# Altium project Practica_3_Rober.PrjPcb
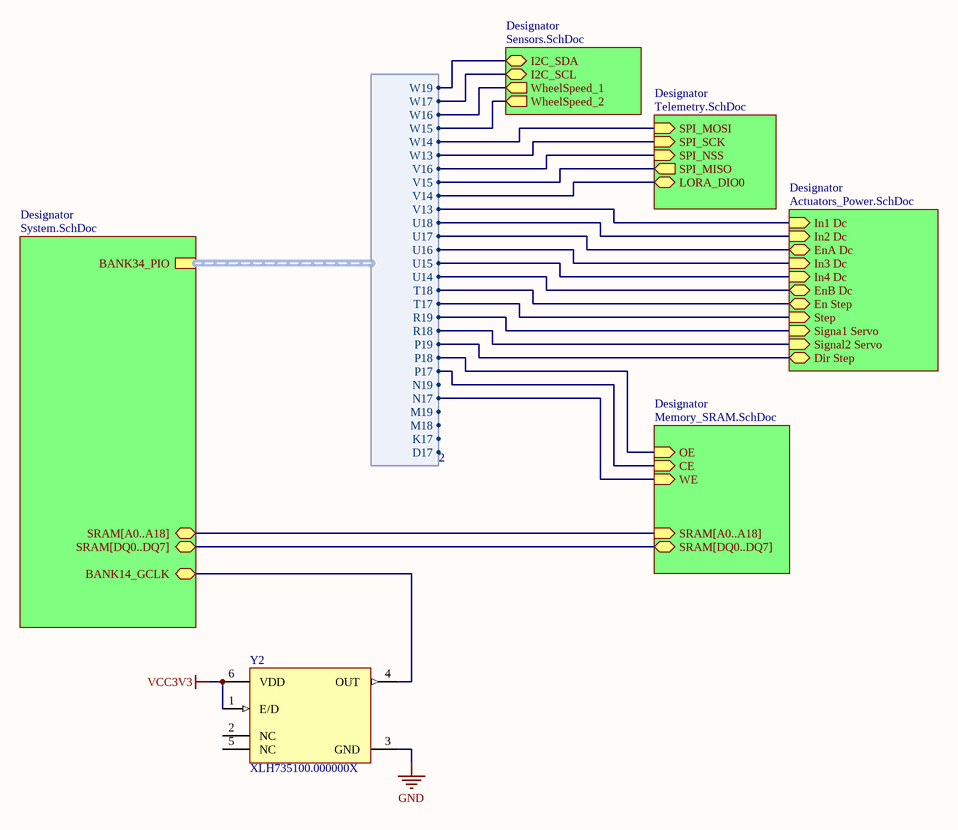
[diagram p0: Main_TopSheet.SchDoc]
7 sheets, 137 parts. Net scope: hierarchical (ports join the sheet entries above them; power ports are global).
Board file: PCB1.PcbDoc
Sheets:
  Main_TopSheet.SchDoc
    Designator = Sensors.SchDoc
    Designator = Telemetry.SchDoc
    Designator = Actuators_Power.SchDoc
    Designator = System.SchDoc
    Designator = Memory_SRAM.SchDoc
  Power.SchDoc

## Sheet Main_TopSheet.SchDoc
size A4; SheetNumber: 1; SheetTotal: 7

### Parts
Y2  XLH735100.000000X  [JU6_MFG]

### Sub-sheets
Designator = Sensors.SchDoc: I2C_SDA (bidir), I2C_SCL (bidir), WheelSpeed_1 (out), WheelSpeed_2 (out)
Designator = Telemetry.SchDoc: SPI_MOSI (in), SPI_SCK (in), SPI_NSS (in), SPI_MISO (out), LORA_DIO0 (bidir)
Designator = Actuators_Power.SchDoc: In1 Dc (in), In2 Dc (in), EnA Dc (bidir), In3 Dc (in), In4 Dc (in), EnB Dc (bidir), En Step (bidir), Step (in), Signa1 Servo (in), Signal2 Servo (in), Dir Step (bidir)
Designator = System.SchDoc: BANK34_PIO (harness 2), BANK14_GCLK (bidir), SRAM[A0..A18] (bidir), SRAM[DQ0..DQ7] (bidir)
Designator = Memory_SRAM.SchDoc: CE (in), OE (in), WE (in), SRAM[A0..A18] (in), SRAM[DQ0..DQ7] (bidir)

### Harnesses
2: D17, K17, M18, M19, N17, N19, P17, P18, P19, R18, R19, T17, T18, U14, U15, U16, U17, U18, V13, V14, V15, V16, W13, W14, W15, W16, W17, W19

### Nets
GND: Y2.3(GND)
VCC3V3: Y2.1(E/D) Y2.6(VDD) ; sheet Designator/WheelSpeed_1, sheet Designator/WheelSpeed_2, sheet Designator/BANK34_PIO.W15, sheet Designator/BANK34_PIO.W16
NetLoRa1_8: sheet Designator/LORA_DIO0, sheet Designator/BANK34_PIO.V14
NetLoRa1_16: sheet Designator/SPI_SCK, sheet Designator/BANK34_PIO.W13
NetLoRa1_17: sheet Designator/SPI_MISO, sheet Designator/BANK34_PIO.V15
NetLoRa1_18: sheet Designator/SPI_MOSI, sheet Designator/BANK34_PIO.W14
NetLoRa1_19: sheet Designator/SPI_NSS, sheet Designator/BANK34_PIO.V16
NetMD7_18: sheet Designator/I2C_SDA, sheet Designator/BANK34_PIO.W19
NetMD7_19: sheet Designator/I2C_SCL, sheet Designator/BANK34_PIO.W17
NetP1_1: sheet Designator/Signal2 Servo, sheet Designator/BANK34_PIO.R18
NetP2_1: sheet Designator/Signa1 Servo, sheet Designator/BANK34_PIO.R19
NetU1C_L17: Y2.4(OUT) ; sheet Designator/BANK14_GCLK
NetU2#2_B3: sheet Designator/WE, sheet Designator/BANK34_PIO.N17
NetU2#2_G2: sheet Designator/OE, sheet Designator/BANK34_PIO.P18
NetU2#2_G3: sheet Designator/CE, sheet Designator/BANK34_PIO.P17
NetU9_5: sheet Designator/In1 Dc, sheet Designator/BANK34_PIO.V13
NetU9_6: sheet Designator/EnA Dc, sheet Designator/BANK34_PIO.U17
NetU9_7: sheet Designator/In2 Dc, sheet Designator/BANK34_PIO.U18
NetU9_10: sheet Designator/In3 Dc, sheet Designator/BANK34_PIO.U16
NetU9_11: sheet Designator/In4 Dc, sheet Designator/BANK34_PIO.U15
NetU9_12: sheet Designator/EnB Dc, sheet Designator/BANK34_PIO.U14
NetU10_1: sheet Designator/En Step, sheet Designator/BANK34_PIO.T18
NetU10_7: sheet Designator/Step, sheet Designator/BANK34_PIO.T17
NetU10_8: sheet Designator/Dir Step, sheet Designator/BANK34_PIO.P19

Not connected (* = marked no-connect by the designer): Y2 2(NC) 5(NC)

### Library data of the parts
Y2 = CMP-00572-106941302-3: Crystal ROHS3Compliant Enable/Disable Active Oscillator -20C~70C 47mA 0.055 1.40mm 100MHz; Max Output Frequency: 999.9MHz; Min Input Voltage: 3.135V; Output Type: LVCMOS; Max Input Voltage: 3.465V; ComponentLink1Description: Manufacturer's Website; ComponentLink2URL: https://octopart.com/cad-content/api/get-model-datasheet/15189/106941302; Case/Package: CLCC; Number of Pins: 6; Mount: Surface Mount; ComponentLink2Description: Datasheet URL; Min Operating Temperature: -20°C; HelpURL: https://octopart.com/cad-content/api/get-model-datasheet/15189/106941302; ComponentLink3Description: Manufacturer's Package Drawing; RoHS: Compliant; ComponentLink3URL: https://www.renesas.com/en/document/psc/ju6-package-outline-70-x-50-mm-body-13-mm-thick; Height: 1.45mm; Max Operating Temperature: 70°C; ComponentLink1URL: http://www.renesas.com

## Sheet Sensors.SchDoc
size A4; SheetNumber: 5; SheetTotal: 7
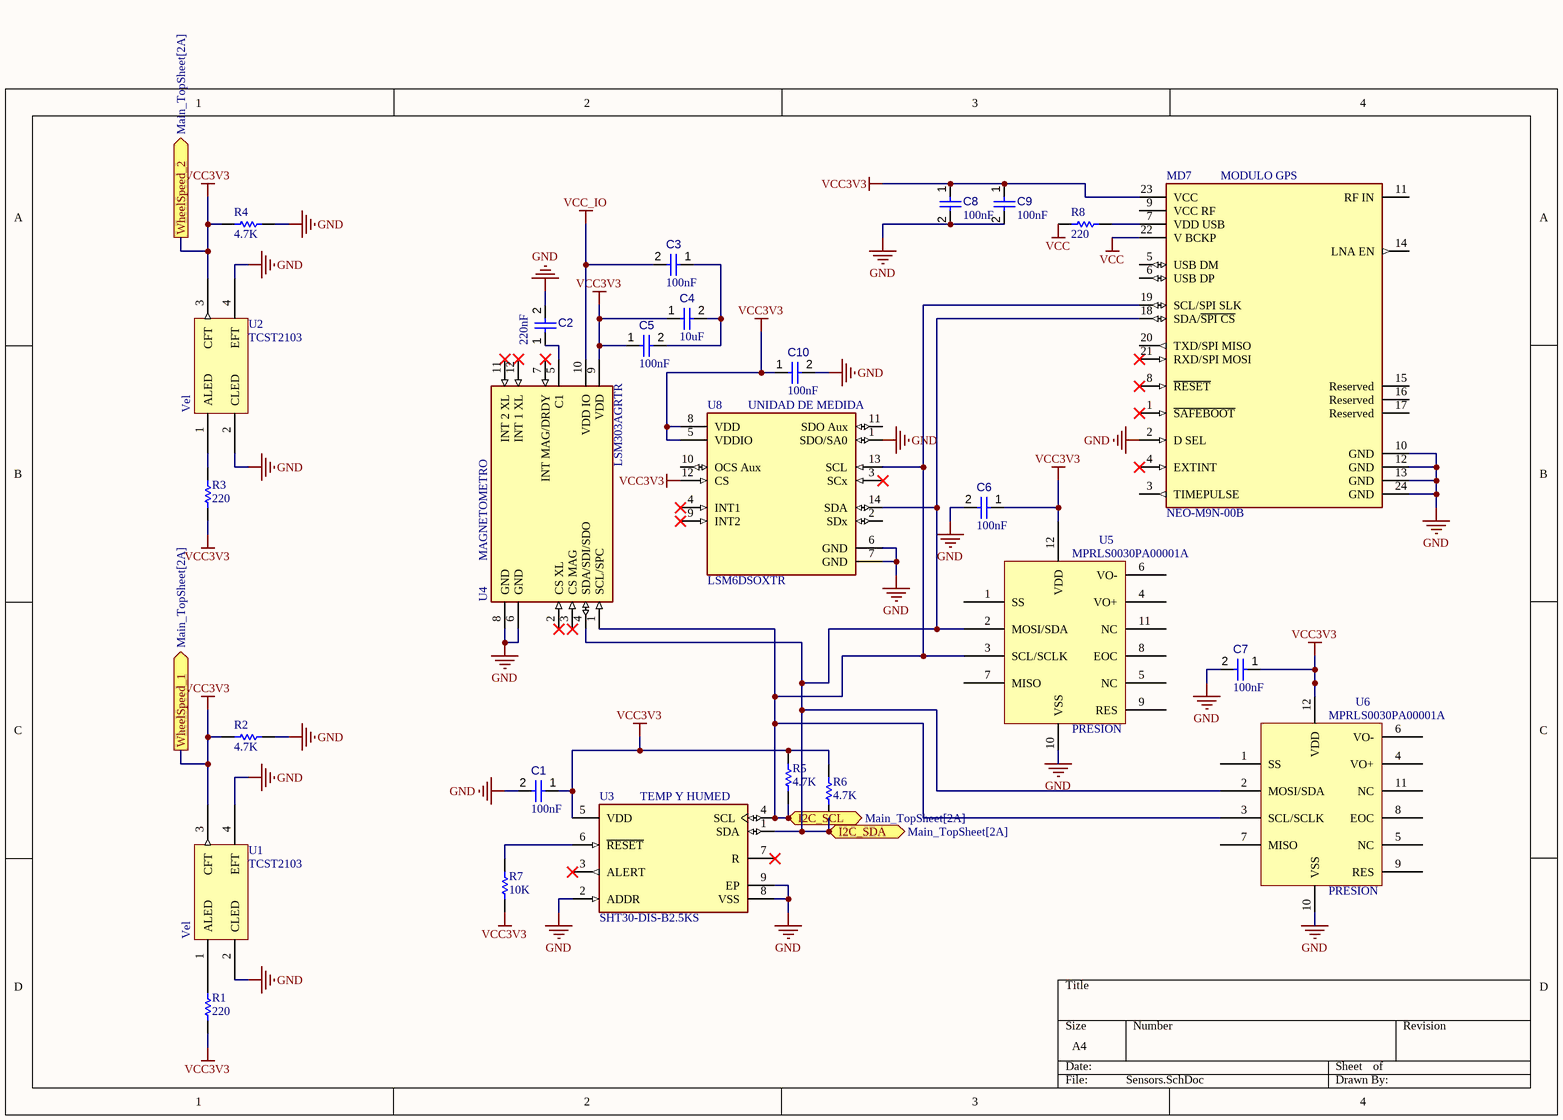
[diagram p1: Sensors.SchDoc]

### Parts
(Parts that share a designator on the sheet are numbered #1, #2 ... from top to bottom, then left to right.)
C1  value 100nF  [CAPC0402(1005)60_L]  (hidden comment: Capacitor 100nF +/-20% 10V 0402)
C2  value 220nF  [CAPC0402(1005)60_L]  (hidden comment: Capacitor 100nF +/-20% 10V 0402)
C3  value 100nF  [CAPC0402(1005)60_L]  (hidden comment: Capacitor 100nF +/-20% 10V 0402)
C4#1  value 10uF  [CAPC0402(1005)60_L]  (hidden comment: Capacitor 100nF +/-20% 10V 0402)
C5  value 100nF  [CAPC0402(1005)60_L]  (hidden comment: Capacitor 100nF +/-20% 10V 0402)
C6#1  value 100nF  [CAPC0402(1005)60_L]  (hidden comment: Capacitor 100nF +/-20% 10V 0402)
C7#1  value 100nF  [CAPC0402(1005)60_L]  (hidden comment: Capacitor 100nF +/-20% 10V 0402)
C8#1  value 100nF  [CAPC0402(1005)60_L]  (hidden comment: Capacitor 100nF +/-20% 10V 0402)
C9#1  value 100nF  [CAPC0402(1005)60_L]  (hidden comment: Capacitor 100nF +/-20% 10V 0402)
C10#1  value 100nF  [CAPC0402(1005)60_L]  (hidden comment: Capacitor 100nF +/-20% 10V 0402)
MD7  NEO-M9N-00B  [FP-NEO-M9N-00B-MFG]
R1  value 220  [RESC1005X40X25ML05T10]  (hidden comment: Resistor 51k +/-5% 0402 63 mW)
R2  value 4.7K  [RESC1005X40X25ML05T10]  (hidden comment: Resistor 51k +/-5% 0402 63 mW)
R3  value 220  [RESC1005X40X25ML05T10]  (hidden comment: Resistor 51k +/-5% 0402 63 mW)
R4  value 4.7K  [RESC1005X40X25ML05T10]  (hidden comment: Resistor 51k +/-5% 0402 63 mW)
R5  value 4.7K  [RESC1005X40X25ML05T10]  (hidden comment: Resistor 51k +/-5% 0402 63 mW)
R6  value 4.7K  [RESC1005X40X25ML05T10]  (hidden comment: Resistor 51k +/-5% 0402 63 mW)
R7  value 10K  [RESC1005X40X25ML05T10]  (hidden comment: Resistor 51k +/-5% 0402 63 mW)
R8  value 220  [RESC1005X40X25ML05T10]  (hidden comment: Resistor 51k +/-5% 0402 63 mW)
U1  TCST2103  [TCST2103-Footprint-1]
U2#1  TCST2103  [TCST2103-Footprint-1]
U3  SHT30-DIS-B2.5KS  [FP-SHT30-DIS-B2_5KS-MFG]
U4  LSM303AGRTR  [FP-LGA-12-8487206-MFG]
U5  MPRLS0030PA00001A  [LGA12C85P2X6_500X500X150]
U6  MPRLS0030PA00001A  [LGA12C85P2X6_500X500X150]
U8  LSM6DSOXTR  [FP-LGA-14L-DM00249496-MFG]

### Ports
I2C_SCL (bidir, see Main_TopSheet[2A]), I2C_SDA (bidir, see Main_TopSheet[2A]), WheelSpeed_1 (out, see Main_TopSheet[2A]), WheelSpeed_2 (out, see Main_TopSheet[2A])

### Nets
GND: C1.2 C2.2 C6#1.2 C7#1.2 C8#1.2 C9#1.2 C10#1.2 MD7.2(D_SEL) MD7.10(GND) MD7.12(GND) MD7.13(GND) MD7.24(GND) R2.2 R4.2 U1.2(CLED) U1.4(EFT) U2#1.2(CLED) U2#1.4(EFT) U3.2(ADDR) U3.8(VSS) U3.9(EP) U4.6(GND) U4.8(GND) U5.10(VSS) U6.10(VSS) U8.1(SDO/SA0) U8.6(GND) U8.7(GND)
VCC: MD7.22(V_BCKP) R8.2
VCC3V3: C1.1 C4#1.1 C5.1 C6#1.1 C7#1.1 C8#1.1 C9#1.1 C10#1.1 MD7.23(VCC) R1.2 R2.1 R3.2 R4.1 R5.1 R6.1 R7.2 U1.3(CFT) U2#1.3(CFT) U3.5(VDD) U4.9(VDD) U5.12(VDD) U6.12(VDD) U8.5(VDDIO) U8.8(VDD) U8.12(CS) ; port WheelSpeed_1, port WheelSpeed_2
VCC_IO: C3.2 U4.10(VDD_IO)
NetC2_1: C2.1 U4.5(C1)
NetC3_1: C3.1 C4#1.2 C5.2
NetMD7_7: MD7.7(VDD_USB) R8.1
NetMD7_18: MD7.18(SDA/~{SPI_CS}) R6.2 U3.1(SDA) U4.4(SDA/SDI/SDO) U5.2(MOSI/SDA) U6.2(MOSI/SDA) U8.14(SDA) ; port I2C_SDA
NetMD7_19: MD7.19(SCL/SPI_SLK) R5.2 U3.4(SCL) U4.1(SCL/SPC) U5.3(SCL/SCLK) U6.3(SCL/SCLK) U8.13(SCL) ; port I2C_SCL
NetR1_1: R1.1 U1.1(ALED)
NetR3_1: R3.1 U2#1.1(ALED)
NetR7_1: R7.1 U3.6(~{RESET})

Not connected (* = marked no-connect by the designer): MD7 1(~{SAFEBOOT})* 3(TIMEPULSE) 4(EXTINT)* 5(USB_DM) 6(USB_DP) 8(~{RESET})* 9(VCC_RF) 11(RF_IN) 14(LNA_EN) 15(Reserved) 16(Reserved) 17(Reserved) 20(TXD/SPI_MISO) 21(RXD/SPI_MOSI)*; U3 3(ALERT)* 7(R)*; U4 2(CS_XL)* 3(CS_MAG)* 7(INT_MAG/DRDY)* 11(INT_2_XL)* 12(INT_1_XL)*; U5 1(SS) 4(VO+) 5(NC) 6(VO-) 7(MISO) 8(EOC) 9(RES) 11(NC); U6 1(SS) 4(VO+) 5(NC) 6(VO-) 7(MISO) 8(EOC) 9(RES) 11(NC); U8 2(SDx) 3(SCx)* 4(INT1)* 9(INT2)* 10(OCS_Aux) 11(SDO_Aux)

### Notes on the sheet
- (near MD7) MODULO GPS
- (near U8) UNIDAD DE MEDIDA
- (near U4) MAGNETOMETRO
- (near U5) PRESION
- (near U3) TEMP Y HUMED
- (near U6) PRESION
- (in symbol CMP-010-00024-2) Vel

### Library data of the parts
C1-C3 C4#1 C5 C6#1 C7#1 C8#1 C9#1 C10#1 = CMP-001-00061-3: Chip Capacitor, 100nF +/-20%, 10V, 0402, Thickness 0.6 mm; Tolerance: 20%; Mounting Technology: SMT; Voltage Rating: 10V; Max Operating Temperature: 85°C; Pins: 2; Case/Package: 0402; Min Operating Temperature: -55°C
MD7 = CMP-207130-000006-2: M9 standard precision module; Manufacturer: u-blox; Min Supply Voltage: 1.65V; Sensitivity: -167dBm; Interface: I2C,SPI,UART,USB; Max Supply Voltage: 3.6V; Device Class L3: RF Receivers; Category: UNK; Temperature Range Low: -40°C; Temperature Range High: +85°C; ComponentLink2Description: Datasheet; Manufacturer Part Number: NEO-M9N-00B; ComponentLink2URL: https://www.u-blox.com/sites/default/files/NEO-M9N_DataSheet_%28UBX-19014285%29.pdf; Footprint Url: https://www.u-blox.com/sites/default/files/NEO-M9N_Integrationmanual_%28UBX-19014286%29.pdf; Height: 2.6mm; Automotive: No; RoHS: TRUE; Lead Free: Yes; Octopart: https://octopart.com/neo-m9n-00b-u-blox-107315722; Package: 0; Temperature: -40°C to +85°C; Device Class L1: Integrated Circuits (ICs); Device Class L2: RF Semiconductors and Devices
R1-R8 = CMP-009-00000-5: Chip Resistor, 51 KOhm, +/- 5%, 0.063 W, -55 to 155 degC, 0402 (1005 Metric); Power: 63mW; Case/Package: 0402; Min Operating Temperature: -55°C; Mounting Technology: SM; RoHS Compliant: True; Max Operating Temperature: 155°C; Tolerance: 5%; Pins: 2
U1 U2#1 = CMP-010-00024-2: Vishay TCST2103 CNY37 Photoelectric Fork Sensor Optoelectronic Sensing; Output Current: 100mA; Max Operating Temperature: 85°C; Min Operating Temperature: -55°C; Mounting Technology: Through Hole; Pins: 4
U3 = CMP-144040-000006-1: SENSOR HUMID/TEMP 5V I2C 3% SMD
U4 = CMP-2000-07465-2: IMU ACCEL/MAG I2C/SPI 12LGA; Manufacturer: STMicroelectronics; Accel Range: 2/4/8/16g; Operating Supply Current: 3.7-200uA; Sensor Output: I2C,SPI; Accel Resolution: 16bits; Max Supply Voltage: 3.6V; Min Supply Voltage: 1.71V; Mag Sense Range: 49.152gauss (g); Sensor Type: Temperature,Accelerometer,Magnetometer; Mouser Description: IMUs - Inertial Measurement Units Ultra-compact high-performance e-compass 3D accelerometer and 3D magnetometer module; Temperature Range High: +85°C; Package: LGA-12-8487206; Manufacturer Part Number: LSM303AGRTR; Category: IC; Device Class L3: Inertial Measurement Units (IMUs); Temperature: -40°C to +85°C; Device Class L2: Motion Sensors; ComponentLink2Description: Datasheet; Octopart: https://octopart.com/lsm303agrtr-stmicroelectronics-59386630; Automotive: No; Device Class L1: Sensors; Resolution: 16bits; RoHS: TRUE; Height: 1mm; ComponentLink2URL: https://www.st.com/resource/en/datasheet/lsm303agr.pdf; Lead Free: Yes; Temperature Range Low: -40°C; Footprint Url: https://www.st.com/content/ccc/resource/technical/document/technical_note/73/17/9c/16/dd/96/4a/01/CD00134799.pdf/files/CD00134799.pdf/jcr:content/translations/en.CD00134799.pdf; Digikey Description: IMU ACCEL/MAG I2C/SPI 12LGA
U5 U6 = CMP-010-00026-1: Piezoresistive Sensor, Absolute, 0Psi Min, 30Psi Max, 0.25%, 0.20-0.80V, Square, Board Mount; Min Supply Voltage: 1.8V; Max Supply Voltage: 3.6V; Max Operating Temperature: 85°C; Min Operating Temperature: -40°C
U8 = CMP-12177-000010-1: INEMO INERTIAL MODULE: 3D ACCELE; Manufacturer: STMicroelectronics; Sensor Type: Temperature,Accelerometer,Gyroscope; Accel Range: 2/4/8/16g; Accel Sensitivity: 0.061/0.122/0.244/0.488mV/g; Operating Supply Current: 0.55mA; Gyro Range: 125/250/500/1000/2000°/s; Gyro Sensitivity: 4.375/8.75/17.5/35/70LSB/°/s; Sensor Output: I2C,SPI,Other; Min Supply Voltage: 1.62V; Max Supply Voltage: 3.6V; Octopart: https://octopart.com/lsm6dsoxtr-stmicroelectronics-98102600; Package: LGA-14L-DM00249496; Footprint Url: https://www.st.com/content/ccc/resource/technical/document/technical_note/73/17/9c/16/dd/96/4a/01/CD00134799.pdf/files/CD00134799.pdf/jcr:content/translations/en.CD00134799.pdf; ComponentLink2Description: Datasheet; Mouser Description: LSM6DSOX: 3.6 V 3 Axis Accelerometer Gyroscope iNEMO Inertial Module - LGA-14L; ComponentLink2URL: https://www.st.com/resource/en/datasheet/lsm6dsox.pdf; Temperature Range Low: -40°C; Digikey Description: INEMO INERTIAL MODULE: 3D ACCELE; Lead Free: Yes; Device Class L3: Inertial Measurement Units (IMUs); Category: IC; Device Class L2: Motion Sensors; RoHS: TRUE; Temperature: -40°C to +85°C; Height: 0.86mm; Device Class L1: Sensors; Temperature Range High: +85°C; Manufacturer Part Number: LSM6DSOXTR; Automotive: No

## Sheet Telemetry.SchDoc
size A4; SheetNumber: 6; SheetTotal: 6
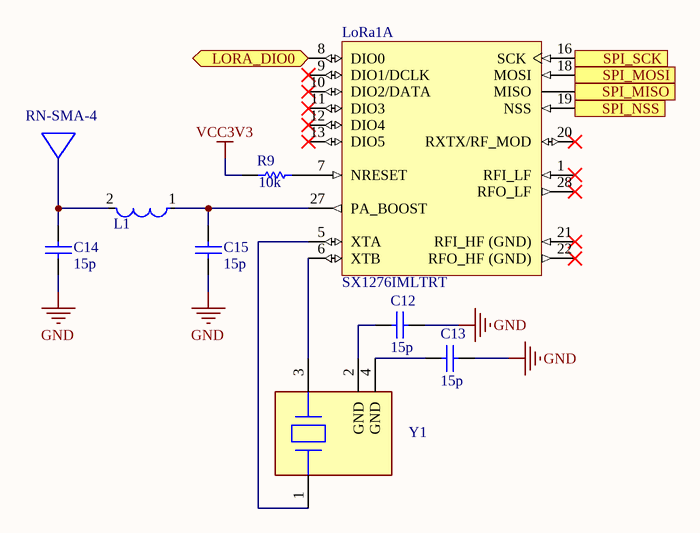
[diagram p2: Telemetry.SchDoc]

### Parts
(Parts that share a designator on the sheet are numbered #1, #2 ... from top to bottom, then left to right.)
ANT1  RN-SMA-4  [FP-RN-SMA-4-MFG]
C12#1  value 15p  (hidden comment: Capacitor)
C13  value 15p  (hidden comment: Capacitor)
C14#1  value 15p  (hidden comment: Capacitor)
C15#1  value 15p  (hidden comment: Capacitor)
L1  LQW31HN27NJ03L  [FP-LQW31HN_03-MFG]  (value not drawn)
LoRa1  SX1276IMLTRT  [SMTC-QFN-28_V]  (part A of 2)
R9  value 10k  (hidden comment: Resistor)
Y1  (no value)  [FP-ABM11AIG-MFG]

### Ports
LORA_DIO0 (bidir), SPI_MISO (out), SPI_MOSI (in), SPI_NSS (in), SPI_SCK (in)

### Nets
GND: C12#1.2 C13.2 C14#1.1 C15#1.1
VCC3V3: R9.1
NetC12#1_1: C12#1.1 Y1.2(GND)
NetC13_1: C13.1 Y1.4(GND)
NetC14#1_2: C14#1.2 L1.2
NetC15#1_2: C15#1.2 L1.1 LoRa1.27(PA_BOOST)
NetLoRa1_5: LoRa1.5(XTA) Y1.1(1_Crystal)
NetLoRa1_6: LoRa1.6(XTB) Y1.3(2_Crystal)
NetLoRa1_7: LoRa1.7(NRESET) R9.2
NetLoRa1_8: LoRa1.8(DIO0) ; port LORA_DIO0
NetLoRa1_16: LoRa1.16(SCK) ; port SPI_SCK
NetLoRa1_17: LoRa1.17(MISO) ; port SPI_MISO
NetLoRa1_18: LoRa1.18(MOSI) ; port SPI_MOSI
NetLoRa1_19: LoRa1.19(NSS) ; port SPI_NSS

Not connected (* = marked no-connect by the designer): LoRa1 1(RFI_LF)* 9(DIO1/DCLK)* 10(DIO2/DATA)* 11(DIO3)* 12(DIO4)* 13(DIO5)* 20(RXTX/RF_MOD)* 21(RFI_HF_(GND))* 22(RFO_HF_(GND))* 28(RFO_LF)*

### Library data of the parts
ANT1 = CMP-06329-000002-1: RF ANT 2.4GHZ WHIP SMA MALE 4"; Number of Bands: 1; Input Impedance: 50R; VSWR: 1.9; Bandwidth: 120MHz; Frequency: 2.45GHz; REACH SVHC: No SVHC; Height: 4.449inch; Packaging: Bulk; Case/Package: SMA; Package Quantity: 1; Lead Free: Lead Free; Series: -; Termination: SMA; Connector Type: SMA; Radiation Hardening: No; Impedance: 50R; Mount: Connector
C12#1 C13 C14#1 C15#1 = Capacitor: SimulationGenericComponent: True
L1 = CMP-06042-006372-1: Wire Wound RF Inductor 27nH ±5% 0.0714Ω 560mA 1206; Self Resonant Frequency: 1GHz; Shielding: Unshielded; Core Material: Ferrite; Test Frequency: 100MHz; Q Factor: 60; DC Resistance (DCR): 51mR; Mount: Surface Mount; Inductance: 27nH; Max DC Current: 560mA; Military Standard: Not; Height: 1.8mm; Width: 0.063inch; Case Code (Metric): 3216; Height - Seated (Max): 0.079inch; Min Operating Temperature: -40°C; Weight: 0.000705oz; Package Quantity: 2000; Max Operating Temperature: 85°C; Current Rating: 560mA; Case Code (Imperial): 1206; Packaging: Tape and Reel; DC Current: 560mA; Termination: SMD/SMT; Depth: 1.8mm; Resistor Type: Wirewound; Radiation Hardening: No; Case/Package: 1206; Length: 3.2mm; Tolerance: 5%
LoRa1 = CMP-2000-05356-1: Low Power Long Range Transceiver, 137 to 1020 MHz, -40 to 85 degC, 28-Pin QFN, RoHS, Tape and Reel; Manufacturer: Semtech; Power - Output: 20dBm; Data Rate (Max): 300kbps; Sensitivity: -148dBm; Featured Product: SX1276LongRangeTransceiver; PCN Design/Specification: CopperWire25/Mar/2014; GPIO: 6; Frequency: 137MHz~1.02GHz; Voltage - Supply: 1.8V~3.7V; Protocol: LoRa™; Current - Transmitting: 20mA~120mA; Current - Receiving: 10.8mA~12mA; Online Catalog: SX1276,SX1277andSX1278; Design Resources: SX127xReferenceDesignOverviewDevelopmentToolSelector; Serial Interfaces: SPI; Mfg Application Notes: LoRaModulation:CrystalOscillatorGuidanceSX12xxSoftwareImplementationofDataWhiteningandCRCSX127xLoRaLowEnergyDesignGuideSX127xLoRaModemDesignersGuide; Modulation: FSK,GFSK,GMSK,MSK,OOK; Other Names: SX1276IMLTRTTR; Series: -; Manufacturer URL: http://www.semtech.com/; Datasheet URL: http://www.semtech.com/images/datasheet/sx1276.pdf; Type: TxRx+MCU; RF Family/Standard: 802.15.4; Package Reference: QFN-28; Standard Package: 3,000; Package Description: 28-Pin Quad Flat No-lead Package, Body 6 x 6 mm, Pitch 0.65 mm; Category: RF/IFandRFID; Operating Temperature: -40degC~85degC; Datasheet Version: Rev. 4, 03/2015; Memory Size: -; Family: RFTransceiverICs; Packaging: Tape&Reel(TR); Package / Case: 28-VQFNExposedPad
R9 = Resistor: TC1: 0; SimulationGenericComponent: True; TC2: 0
Y1 = CMP-27762-011048-1: Crystal 32MHz ±30ppm 10pF SMD-4 2.5mm x 2mm Automotive; Frequency Stability: 100ppm; ESR (Equivalent Series Resistance): 80R; Max Operating Temperature: 125°C; Frequency Tolerance: 30ppm; Length: 0.098inch; Frequency: 32MHz; RoHS Compliant: Yes; Min Operating Temperature: -40°C; Width: 0.079inch; Load Capacitance: 10pF; Packaging: Tape and Reel; Height: 0.024inch; Mount: Surface Mount; Case/Package: SMD/SMT; Ratings: AEC-Q200

## Sheet Actuators_Power.SchDoc
size A4; SheetNumber: 4; SheetTotal: 6
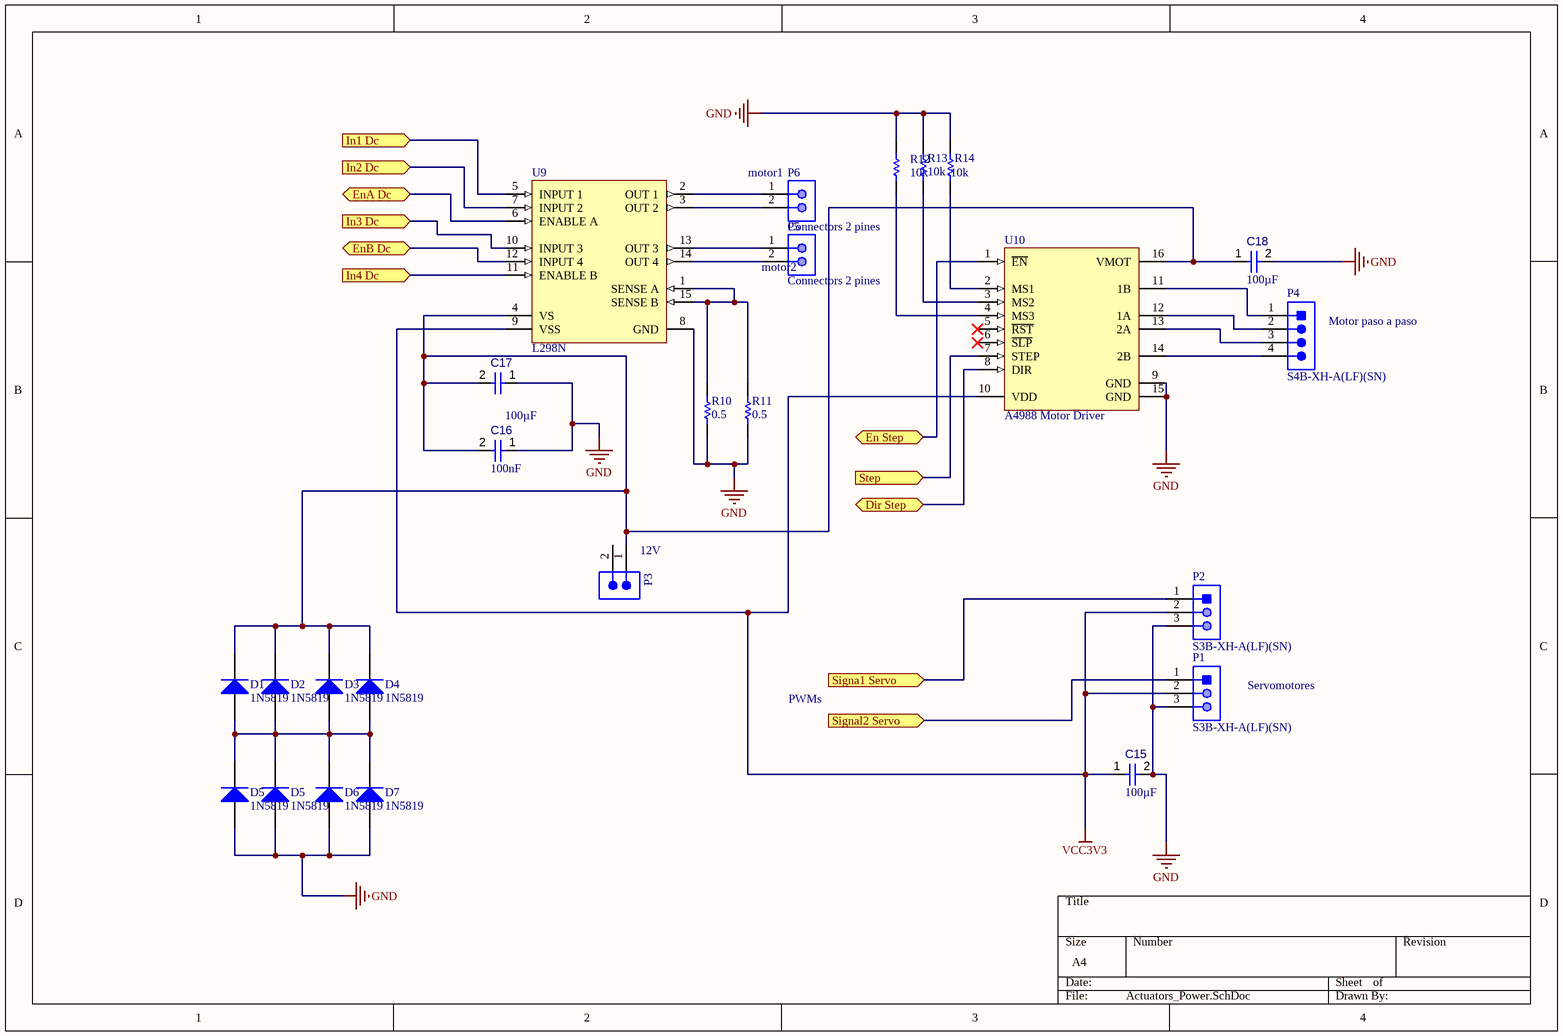
[diagram p3: Actuators_Power.SchDoc]

### Parts
(Parts that share a designator on the sheet are numbered #1, #2 ... from top to bottom, then left to right.)
C15#2  value 100µF  [CAPC3216X190X55LL30T25]  (hidden comment: Capacitor 100 uF +/- 20% 6.3 V 1206)
C16#1  value 100nF  [CAPC0402(1005)60_L]  (hidden comment: Capacitor 100nF +/-20% 10V 0402)
C17#1  value 100µF  [CAPC3216X190X55LL30T25]  (hidden comment: Capacitor 100 uF +/- 20% 6.3 V 1206)
C18#1  value 100µF  [CAPC3216X190X55LL30T25]  (hidden comment: Capacitor 100 uF +/- 20% 6.3 V 1206)
D1  1N5819  [ONSC-AXIAL_LEAD-2-59-10_P]
D2  1N5819  [ONSC-AXIAL_LEAD-2-59-10_P]
D3  1N5819  [ONSC-AXIAL_LEAD-2-59-10_P]
D4  1N5819  [ONSC-AXIAL_LEAD-2-59-10_P]
D5#1  1N5819  [ONSC-AXIAL_LEAD-2-59-10_P]
D5#2  1N5819  [ONSC-AXIAL_LEAD-2-59-10_P]
D6  1N5819  [ONSC-AXIAL_LEAD-2-59-10_P]
D7  1N5819  [ONSC-AXIAL_LEAD-2-59-10_P]
P1  S3B-XH-A(LF)(SN)  [JST-S3B-XH-A(LF)(SN)_V]
P2  S3B-XH-A(LF)(SN)  [JST-S3B-XH-A(LF)(SN)_V]
P3  691701510002B  [691701510002B]  (value not drawn)
P4  S4B-XH-A(LF)(SN)  [JST-S4B-XH-A(LF)(SN)_V]
P5  Connectors 2 pines  [AMPH-68000-102HLF_V]
P6  Connectors 2 pines  [AMPH-68000-102HLF_V]
R10  value 0.5  [RESC3116X70X50ML13T20]  (hidden comment: Resistor 1k +/-1% 1206 250 mW)
R11  value 0.5  [RESC3116X70X50ML13T20]  (hidden comment: Resistor 1k +/-1% 1206 250 mW)
R12  value 10k  [RESC3116X70X50ML13T20]  (hidden comment: Resistor 1k +/-1% 1206 250 mW)
R13  value 10k  [RESC3116X70X50ML13T20]  (hidden comment: Resistor 1k +/-1% 1206 250 mW)
R14  value 10k  [RESC3116X70X50ML13T20]  (hidden comment: Resistor 1k +/-1% 1206 250 mW)
U9  L298N  [STM-FM-15]
U10  A4988 Motor Driver  [Polo-A4988 Motor Driver_V]

### Ports
Dir Step (bidir), En Step (bidir), EnA Dc (bidir), EnB Dc (bidir), In1 Dc (in), In2 Dc (in), In3 Dc (in), In4 Dc (in), Signa1 Servo (in), Signal2 Servo (in), Step (in)

### Nets
GND: C15#2.2 C16#1.1 C17#1.1 C18#1.2 D5#1.1(A) D5#2.1(A) D6.1(A) D7.1(A) P1.3 P2.3 R10.1 R11.1 R12.2 R13.2 R14.2 U9.8(GND) U10.9(GND) U10.15(GND)
VCC3V3: C15#2.1 P1.2 P2.2 U9.9(VSS) U10.10(VDD)
NetC16#1_2: C16#1.2 C17#1.2 C18#1.1 D1.2(K) D2.2(K) D3.2(K) D4.2(K) P3.1 U9.4(VS) U10.16(VMOT)
NetD1_1: D1.1(A) D2.1(A) D3.1(A) D4.1(A) D5#1.2(K) D5#2.2(K) D6.2(K) D7.2(K)
NetP1_1: P1.1 ; port Signal2 Servo
NetP2_1: P2.1 ; port Signa1 Servo
NetP4_1: P4.1 U10.11(1B)
NetP4_2: P4.2 U10.12(1A)
NetP4_3: P4.3 U10.13(2A)
NetP4_4: P4.4 U10.14(2B)
NetP5_1: P5.1 U9.13(OUT_3)
NetP5_2: P5.2 U9.14(OUT_4)
NetP6_1: P6.1 U9.2(OUT_1)
NetP6_2: P6.2 U9.3(OUT_2)
NetR10_2: R10.2 R11.2 U9.1(SENSE_A) U9.15(SENSE_B)
NetR12_1: R12.1 U10.4(MS3)
NetR13_1: R13.1 U10.3(MS2)
NetR14_1: R14.1 U10.2(MS1)
NetU9_5: U9.5(INPUT_1) ; port In1 Dc
NetU9_6: U9.6(ENABLE_A) ; port EnA Dc
NetU9_7: U9.7(INPUT_2) ; port In2 Dc
NetU9_10: U9.10(INPUT_3) ; port In3 Dc
NetU9_11: U9.11(ENABLE_B) ; port In4 Dc
NetU9_12: U9.12(INPUT_4) ; port EnB Dc
NetU10_1: U10.1(~{EN}) ; port En Step
NetU10_7: U10.7(STEP) ; port Step
NetU10_8: U10.8(DIR) ; port Dir Step

Not connected (* = marked no-connect by the designer): P3 2; U10 5(~{RST})* 6(~{SLP})*

### Notes on the sheet
- (near P6) motor1
- (near P5) motor2
- (near P4) Motor paso a paso
- (near P3) 12V
- PWMs
- Servomotores

### Library data of the parts
C15#2 C17#1 C18#1 = CMP-001-00019-6: Chip Capacitor, 100 uF, +/- 20%, 6.3 V, 1206 (3216 Metric); Voltage Rating: 6.3V; Capacitor Type: Ceramic; Tolerance: 20%; Pins: 2; Case/Package: 1206; Max Operating Temperature: 85°C; RoHS Compliant: True; Mounting Technology: SM; Min Operating Temperature: -55°C
C16#1 = CMP-001-00061-3: as C1 on sheet Sensors; Mounting Technology: SMT; Voltage Rating: 10V; Max Operating Temperature: 85°C; Pins: 2; Case/Package: 0402; Min Operating Temperature: -55°C
D1-D4 D5#1 D5#2 D6 D7 = CMP-004-00009-2: Low Drop Power Schottky Rectifier, 40 V, 1 A, 2-Pin DO-41, RoHS; Manufacturer: ON Semiconductor; Max Surge Current: 25A; Forward Current: 1A; Package Version: Rev. U, 02/2005; Peak Reverse Current: 1mA; Max Operating Temperature: 125°C; Case/Package: DO; Package URL: http://www.onsemi.cn/pub_link/Collateral/59-10.PDF; Packaging: Bulk; Manufacturer URL: http://www.onsemi.com/; Min Operating Temperature: -65°C; Package Description: 2-Pin, Axial Lead, Diameter 2.35 mm; Mounting Technology: TH; Datasheet URL: http://www.onsemi.cn/pub_link/Collateral/1N5817-D.PDF; Datasheet Version: Rev. 10, 07/2006; Package Reference: AXIAL_LEAD-2-59-10; Pins: 2; RoHS Compliant: True
P1 P2 = CMP-002-00033-2: Male Header, Pitch 2.5 mm, 1 x 3 Position, Height 6.1 mm, Tail Length 3.4 mm, -25 to 85 degC, RoHS, Bulk; Manufacturer: JST; Package Description: Male Header, Pitch 2.5 mm, 1 x 3 Position, Height 6.1 mm, Tail Length 3.4 mm; Manufacturer URL: http://www.jst.com/home2.html; Datasheet URL: http://www.jst-mfg.com/product/pdf/eng/eXH.pdf; RoHS Compliant: Unknown; Connector Type: Header; Package Reference: S3B-XH-A(LF)(SN); Gender: Male; Case/Package: S3B-XH-A(LF)(SN); Mounting Technology: TH; Max Operating Temperature: 85°C; Min Operating Temperature: -25°C; Datasheet Version: May-16
P3 = CMP-1502-02329-3: HEADER, 5.08MM, CLOSED SIDED, 2WAY; Connector Type: Terminal Block; Connector Mou; Voltage Rating: 300V; Number of Contacts: 2; Current Rating: 10A; Gender: Male; RoHS: Compliant; Min Operating Temperature: -40°C; Contact Gender: Male; Number of Pins: 2; Contact Material: Brass; Contact Plating: Tin; Termination: PCB; Pitch: 5.08mm; Max Operating Temperature: 105°C; Length: 12.96mm; Color: Black; REACH SVHC: Unknown; Housing Material: Polymer; Mount: Through Hole; Lead Pitch: 5.08mm
P4 = CMP-002-00034-2: Male Header, Pitch 2.5 mm, 1 x 4 Position, Height 6.1 mm, Tail Length 3.4 mm, -25 to 85 degC, RoHS, Bulk; Manufacturer: JST; Manufacturer URL: http://www.jst.com/home2.html; RoHS Compliant: Unknown; Gender: Male; Min Operating Temperature: -25°C; Datasheet URL: http://www.jst-mfg.com/product/pdf/eng/eXH.pdf; Case/Package: S4B-XH-A(LF)(SN); Datasheet Version: May-16; Mounting Technology: TH; Package Reference: S4B-XH-A(LF)(SN); Max Operating Temperature: 85°C; Package Description: XH Series Disconnectable Crimp Style Connector, Pitch 2.5 mm, 1 x 4 Position, Height 6.1 mm, Tail Length 3.4 mm; Connector Type: Header
P5 P6 = CMP-002-00071-1: Pin Header, Board-to-Board, 2.54 mm, 1 Rows, 2 Contacts, Through Hole, FCI BergStik II 68000; Max Voltage Rating (AC): 1.5kV; Plating Thickness: 762nm; Mating Post Length: 5.84mm; Voltage Rating: 110V; Gender: Male; Pitch: 2.54mm; Dielectric Material: Polyethylene; Current Rating: 3A; Number of Contacts: 2; Connector Type: Male Pin; Insulation Resistance: 5GΩ; Lead Length: 2.41mm; Height: 8.7mm; Contact Material: Gold; Contact Plating: Gold; Min Operating Temperature: -65°C; Housing Color: Black; RoHS: Compliant; Packaging: Bulk; Terminal Pitch: 2.54mm; Lifecycle Status: Production; Max Operating Temperature: 125°C; China RoHS: Compliant; REACH SVHC: Yes; Pins: 2; Contact Mating Length: 5.842mm; Introduction Date: 2006-08-30; Depth: 2.41mm; Mounting Technology: Through Hole; Voltage Rating (DC): 1.5kV; Number of Rows: 1; Termination: Solder; Orientation: Straight; Lead Free: Lead Free; Length: 5.08mm; Harmonized Tariff Schedule (HTS) Code: 8536.69.40.40; Contact Gender: Male; Flammability Rating: UL94 V-0; Color: Black; Radiation Hardening: No; Export Control Classification Number (ECCN) Code: EAR99; Lead Pitch: 2.54mm
R10-R14 = CMP-009-00011-5: Chip Resistor, 1 KOhm, +/- 1%, 0.25 W, -55 to 155 degC, 1206 (3216 Metric); Voltage Rating: 200V; Power: 250mW; Max Operating Temperature: 155°C; Mounting Technology: SM; Tolerance: 1%; Case/Package: 1206; RoHS Compliant: True; Min Operating Temperature: -55°C; Pins: 2
U9 = CMP-00024-00007-1: Motor Driver, DC Brush, Full Bridge, 4 Outputs, 4.8V to 46V Supply, 2A Out, Multiwatt-15; Number of Drivers: 2; Drain to Source Resistance: 930mΩ; Interface: Parallel; Operating Supply Current: 13mA; Max Collector Current: 3A; Quiescent Current: 500mA; Max Output current: 4A; Operating Supply Voltage: 5V; Motor Type: Brushed; Min Supply Voltage: 4.5V; Max Supply Voltage: 7V; Number of Outputs: 4; Collector Emitter Voltage (VCEO): 46V; Min Supply Voltage (DC): 4.8V; Lead Free: Lead Free; Lifecycle Status: Production; Height: 10.7mm; Pins: 13; RoHS: Compliant; Number of Circuits: 2; REACH SVHC: No; Min Operating Temperature: -40°C; Output Current per Channel: 2A; Output Voltage: 46V; Number of Terminals: 15; Radiation Hardening: No; Schedule B: 8542390000, 8542390000; Length: 19.6mm; Max Operating Temperature: 150°C; Terminal Pitch: 1.27mm; Number of Transmitters: 2; Mounting Technology: Through Hole; Output Current: 2A; Width: 5mm; Number of Channels: 2; Height - Seated (Max): 21mm; China RoHS: Non-Compliant
U10 = CMP-00024-00002-2: Stepper Motor Driver Carrier, 3 to 5.5 V, 2 A, 16-Pin THD; Manufacturer: Pololu Robotics & Electronics; Datasheet Version: Dec-15; Package Description: 16-Pin Through Hole Device, Body 20.3 x 15.2 mm, Pitch 2.54 mm; Case/Package: A4988MotorDriver; Mounting Technology: TH; RoHS Compliant: Unknown; Datasheet URL: https://www.pololu.com/file/0J1082/a4988-stepper-motor-driver-carrier-dimension-diagram.pdf; Package Reference: A4988 Motor Driver

## Sheet System.SchDoc
size A4; SheetNumber: 3; SheetTotal: 7
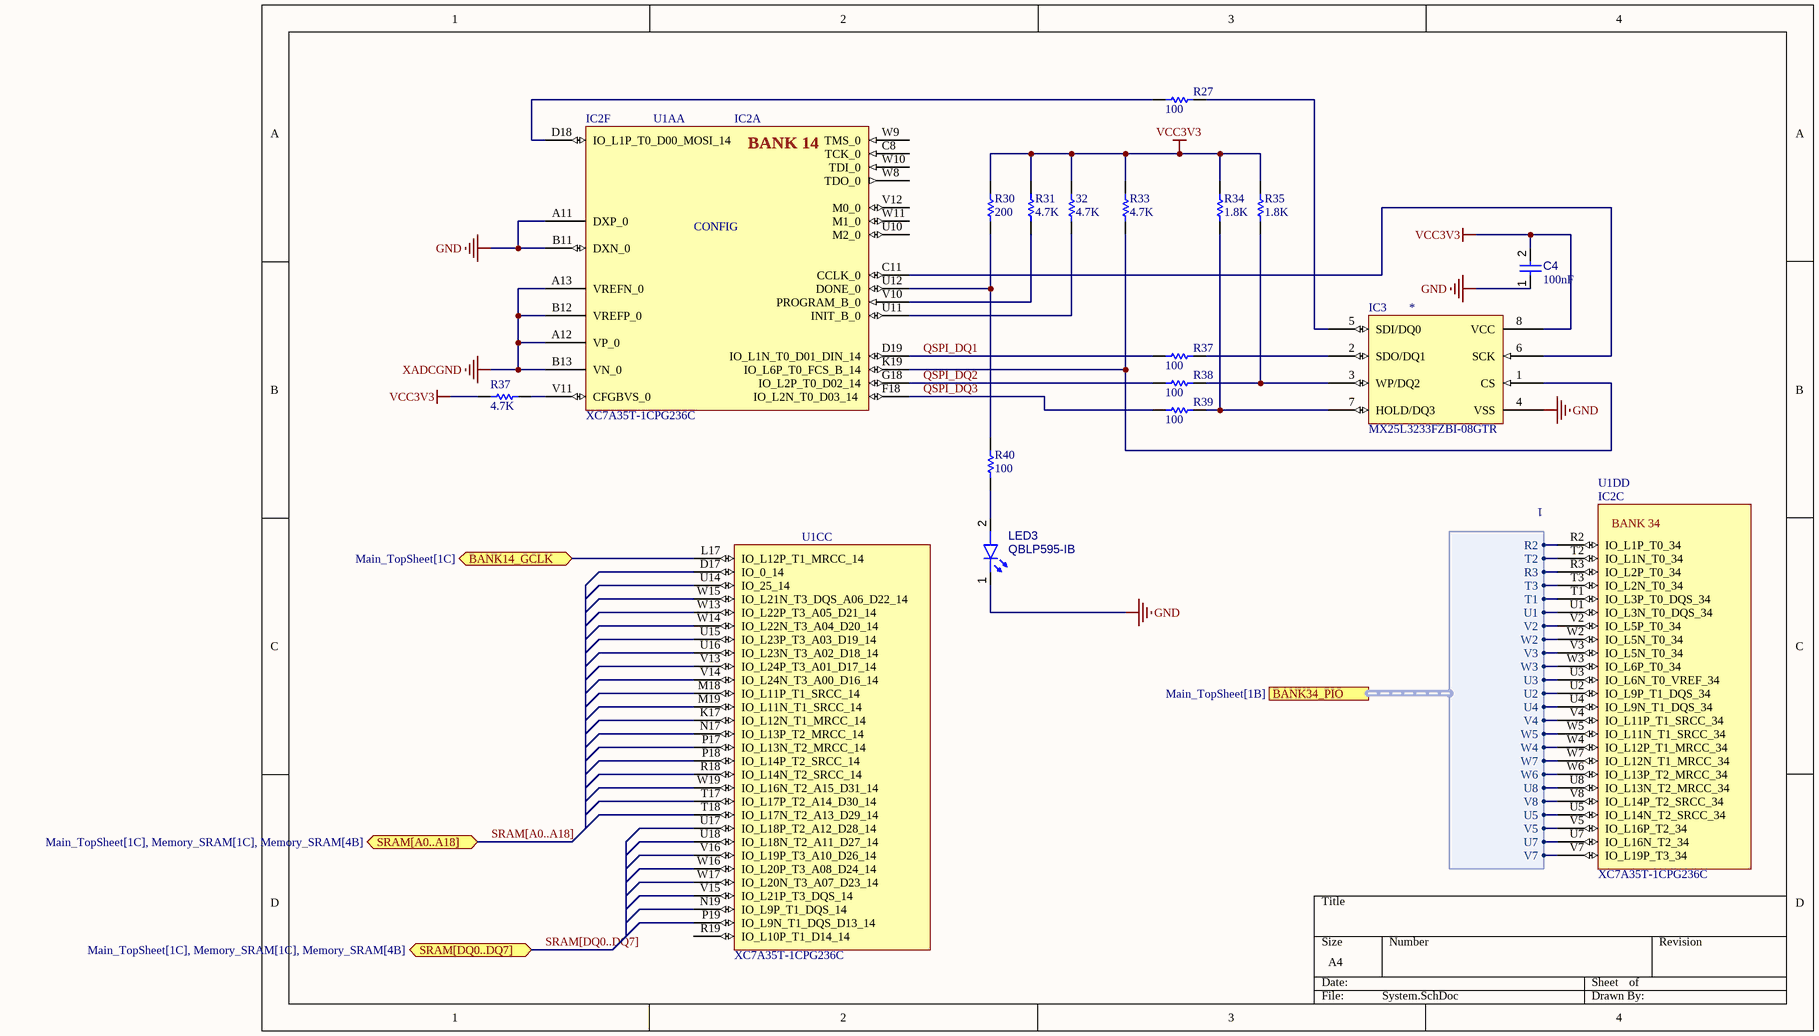
[diagram p4: System.SchDoc]

### Parts
(Parts that share a designator on the sheet are numbered #1, #2 ... from top to bottom, then left to right.)
32  value 4.7K  [RESC1005X40X25ML05T10]  (hidden comment: Resistor 51k +/-5% 0402 63 mW)
*  MX25L3233FZBI-08GTR  [SON127P500X80_HS-9N]
C4#2  value 100nF  [CAPC0402(1005)60_L]  (hidden comment: Capacitor 100nF +/-20% 10V 0402)
LED3  QBLP595-IB  [QTB-QBLP595_V]
R27  value 100  [RESC1005X40X25ML05T10]  (hidden comment: Resistor 51k +/-5% 0402 63 mW)
R30  value 200  [RESC1005X40X25ML05T10]  (hidden comment: Resistor 51k +/-5% 0402 63 mW)
R31  value 4.7K  [RESC1005X40X25ML05T10]  (hidden comment: Resistor 51k +/-5% 0402 63 mW)
R33  value 4.7K  [RESC1005X40X25ML05T10]  (hidden comment: Resistor 51k +/-5% 0402 63 mW)
R34  value 1.8K  [RESC1005X40X25ML05T10]  (hidden comment: Resistor 51k +/-5% 0402 63 mW)
R35  value 1.8K  [RESC1005X40X25ML05T10]  (hidden comment: Resistor 51k +/-5% 0402 63 mW)
R37#1  value 100  [RESC1005X40X25ML05T10]  (hidden comment: Resistor 51k +/-5% 0402 63 mW)
R37#2  value 4.7K  [RESC1005X40X25ML05T10]  (hidden comment: Resistor 51k +/-5% 0402 63 mW)
R38  value 100  [RESC1005X40X25ML05T10]  (hidden comment: Resistor 51k +/-5% 0402 63 mW)
R39  value 100  [RESC1005X40X25ML05T10]  (hidden comment: Resistor 51k +/-5% 0402 63 mW)
R40  value 100  [RESC1005X40X25ML05T10]  (hidden comment: Resistor 51k +/-5% 0402 63 mW)
U1A  XC7A35T-1CPG236C  [BGA81C50P19X19_1000X1000X110]  (part A of 3)
U1C  XC7A35T-1CPG236C  [BGA81C50P19X19_1000X1000X110]  (part C of 4)
U1D  XC7A35T-1CPG236C  [BGA81C50P19X19_1000X1000X110]  (part D of 4)

### Ports
BANK14_GCLK (bidir, see Main_TopSheet[1C]), BANK34_PIO (harness 1, see Main_TopSheet[1B]), SRAM[A0..A18] (bidir, see Main_TopSheet[1C], Memory_SRAM[1C], Memory_SRAM[4B]), SRAM[DQ0..DQ7] (bidir, see Main_TopSheet[1C], Memory_SRAM[1C], Memory_SRAM[4B])

### Harnesses
1: R2, T2, R3, T3, T1, U1, V2, W2, V3, W3, U3, U2, U4, V4, W5, W4, W7, W6, U8, V8, U5, V5, U7, V7

### Nets
GND: *.4(VSS) C4#2.1 LED3.1(K) U1A.A11(DXP_0) U1A.B11(DXN_0)
VCC3V3: 32.2 *.8(VCC) C4#2.2 R30.2 R31.2 R33.2 R34.2 R35.2 R37#2.1
XADCGND: U1A.A12(VP_0) U1A.A13(VREFN_0) U1A.B12(VREFP_0) U1A.B13(VN_0)
QSPI_DQ1: R37#1.1 U1A.D19(IO_L1N_T0_D01_DIN_14)
QSPI_DQ2: R38.1 U1A.G18(IO_L2P_T0_D02_14)
QSPI_DQ3: R39.1 U1A.F18(IO_L2N_T0_D03_14)
Net32_1: 32.1 U1A.U11(INIT_B_0)
Net*_1: *.1(CS) R33.1 U1A.K19(IO_L6P_T0_FCS_B_14)
Net*_2: *.2(SDO/DQ1) R37#1.2
Net*_3: *.3(WP/DQ2) R35.1 R38.2
Net*_5: *.5(SDI/DQ0) R27.2
Net*_6: *.6(SCK) U1A.C11(CCLK_0)
Net*_7: *.7(HOLD/DQ3) R34.1 R39.2
NetLED3_2: LED3.2(A) R40.1
NetR27_1: R27.1 U1A.D18(IO_L1P_T0_D00_MOSI_14)
NetR30_1: R30.1 R40.2 U1A.U12(DONE_0)
NetR31_1: R31.1 U1A.V10(PROGRAM_B_0)
NetR37#2_2: R37#2.2 U1A.V11(CFGBVS_0)
NetU1C_L17: U1C.L17(IO_L12P_T1_MRCC_14) ; port BANK14_GCLK
NetU1D_R2: U1D.R2(IO_L1P_T0_34) ; port BANK34_PIO.R2
NetU1D_R3: U1D.R3(IO_L2P_T0_34) ; port BANK34_PIO.R3
NetU1D_T1: U1D.T1(IO_L3P_T0_DQS_34) ; port BANK34_PIO.T1
NetU1D_T2: U1D.T2(IO_L1N_T0_34) ; port BANK34_PIO.T2
NetU1D_T3: U1D.T3(IO_L2N_T0_34) ; port BANK34_PIO.T3
NetU1D_U1: U1D.U1(IO_L3N_T0_DQS_34) ; port BANK34_PIO.U1
NetU1D_U2: U1D.U2(IO_L9P_T1_DQS_34) ; port BANK34_PIO.U2
NetU1D_U3: U1D.U3(IO_L6N_T0_VREF_34) ; port BANK34_PIO.U3
NetU1D_U4: U1D.U4(IO_L9N_T1_DQS_34) ; port BANK34_PIO.U4
NetU1D_U5: U1D.U5(IO_L14N_T2_SRCC_34) ; port BANK34_PIO.U5
NetU1D_U7: U1D.U7(IO_L16N_T2_34) ; port BANK34_PIO.U7
NetU1D_U8: U1D.U8(IO_L13N_T2_MRCC_34) ; port BANK34_PIO.U8
NetU1D_V2: U1D.V2(IO_L5P_T0_34) ; port BANK34_PIO.V2
NetU1D_V3: U1D.V3(IO_L5N_T0_34) ; port BANK34_PIO.V3
NetU1D_V4: U1D.V4(IO_L11P_T1_SRCC_34) ; port BANK34_PIO.V4
NetU1D_V5: U1D.V5(IO_L16P_T2_34) ; port BANK34_PIO.V5
NetU1D_V7: U1D.V7(IO_L19P_T3_34) ; port BANK34_PIO.V7
NetU1D_V8: U1D.V8(IO_L14P_T2_SRCC_34) ; port BANK34_PIO.V8
NetU1D_W2: U1D.W2(IO_L5N_T0_34) ; port BANK34_PIO.W2
NetU1D_W3: U1D.W3(IO_L6P_T0_34) ; port BANK34_PIO.W3
NetU1D_W4: U1D.W4(IO_L12P_T1_MRCC_34) ; port BANK34_PIO.W4
NetU1D_W5: U1D.W5(IO_L11N_T1_SRCC_34) ; port BANK34_PIO.W5
NetU1D_W6: U1D.W6(IO_L13P_T2_MRCC_34) ; port BANK34_PIO.W6
NetU1D_W7: U1D.W7(IO_L12N_T1_MRCC_34) ; port BANK34_PIO.W7

Not connected (* = marked no-connect by the designer): U1A C8(TCK_0) U10(M2_0) V12(M0_0) W8(TDO_0) W9(TMS_0) W10(TDI_0) W11(M1_0); U1C D17(IO_0_14) K17(IO_L12N_T1_MRCC_14) M18(IO_L11P_T1_SRCC_14) M19(IO_L11N_T1_SRCC_14) N17(IO_L13P_T2_MRCC_14) N19(IO_L9P_T1_DQS_14) P17(IO_L13N_T2_MRCC_14) P18(IO_L14P_T2_SRCC_14) P19(IO_L9N_T1_DQS_D13_14) R18(IO_L14N_T2_SRCC_14) R19(IO_L10P_T1_D14_14) T17(IO_L17P_T2_A14_D30_14) T18(IO_L17N_T2_A13_D29_14) U14(IO_25_14) U15(IO_L23P_T3_A03_D19_14) U16(IO_L23N_T3_A02_D18_14) U17(IO_L18P_T2_A12_D28_14) U18(IO_L18N_T2_A11_D27_14) V13(IO_L24P_T3_A01_D17_14) V14(IO_L24N_T3_A00_D16_14) V15(IO_L21P_T3_DQS_14) V16(IO_L19P_T3_A10_D26_14) W13(IO_L22P_T3_A05_D21_14) W14(IO_L22N_T3_A04_D20_14) W15(IO_L21N_T3_DQS_A06_D22_14) W16(IO_L20P_T3_A08_D24_14) W17(IO_L20N_T3_A07_D23_14) W19(IO_L16N_T2_A15_D31_14)

### Buses and harness runs
bus SRAM[A0..A18] = port SRAM[A0..A18]
bus SRAM[DQ0..DQ7] = port SRAM[DQ0..DQ7]

### Notes on the sheet
- (in symbol CMP-020-00028-1) IC3
- (in symbol CMP-020-00032-2, part A) IC2F; CONFIG
- (in symbol CMP-020-00032-3, part D) IC2C; BANK 34
- (in symbol CMP-020-00032-4, part C) IC2A; BANK 14

### Library data of the parts
32 R27 R30 R31 R33-R35 R37#1 R37#2 R38-R40 = CMP-009-00000-5: as R1 on sheet Sensors; Case/Package: 0402; Min Operating Temperature: -55°C; Mounting Technology: SM; RoHS Compliant: True; Max Operating Temperature: 155°C; Tolerance: 5%; Pins: 2
* = CMP-020-00028-1: NOR Flash Serial-3Wire 3V 32Mbit 32M/16M/8M x 1Bit/2Bit/4Bit 8-Pin USON T/R
C4#2 = CMP-001-00061-3: as C1 on sheet Sensors; Mounting Technology: SMT; Voltage Rating: 10V; Max Operating Temperature: 85°C; Pins: 2; Case/Package: 0402; Min Operating Temperature: -55°C
LED3 = CMP-007-00042-3: Chip LED 0402, Blue, 0.02 A, 3.1 to 3.7 V, -40 to 80 degC, 2-Pin SMD, RoHS, Tape and Reel; RoHS Compliant: Yes; Colour: Blue; Pins: 2; Case/Package: 0402; Mounting Technology: SMT
U1A = CMP-020-00032-2: FPGA Artix-7 Family 33280 Cells 28nm Technology 1V 236-Pin CSBGA; Min Supply Voltage: 950mV; Max Supply Voltage: 1.05V; Clock Frequency: 1.098GHz; RAM Size: 225kB; Pins: 236; Max Operating Temperature: 85°C; Case/Package: LFBGA; Min Operating Temperature: 0°C
U1C = CMP-020-00032-4: FPGA Artix-7 Family 33280 Cells 28nm Technology 1V 236-Pin CSBGA; Clock Frequency: 1.098GHz; Min Supply Voltage: 950mV; RAM Size: 225kB; Max Supply Voltage: 1.05V; Max Operating Temperature: 85°C; Min Operating Temperature: 0°C; Case/Package: LFBGA; Pins: 236
U1D = CMP-020-00032-3: FPGA Artix-7 Family 33280 Cells 28nm Technology 1V 236-Pin CSBGA; Max Supply Voltage: 1.05V; Min Supply Voltage: 950mV; RAM Size: 225kB; Clock Frequency: 1.098GHz; Min Operating Temperature: 0°C; Case/Package: LFBGA; Pins: 236; Max Operating Temperature: 85°C

## Sheet Memory_SRAM.SchDoc
size A4; SheetNumber: 2; SheetTotal: 7
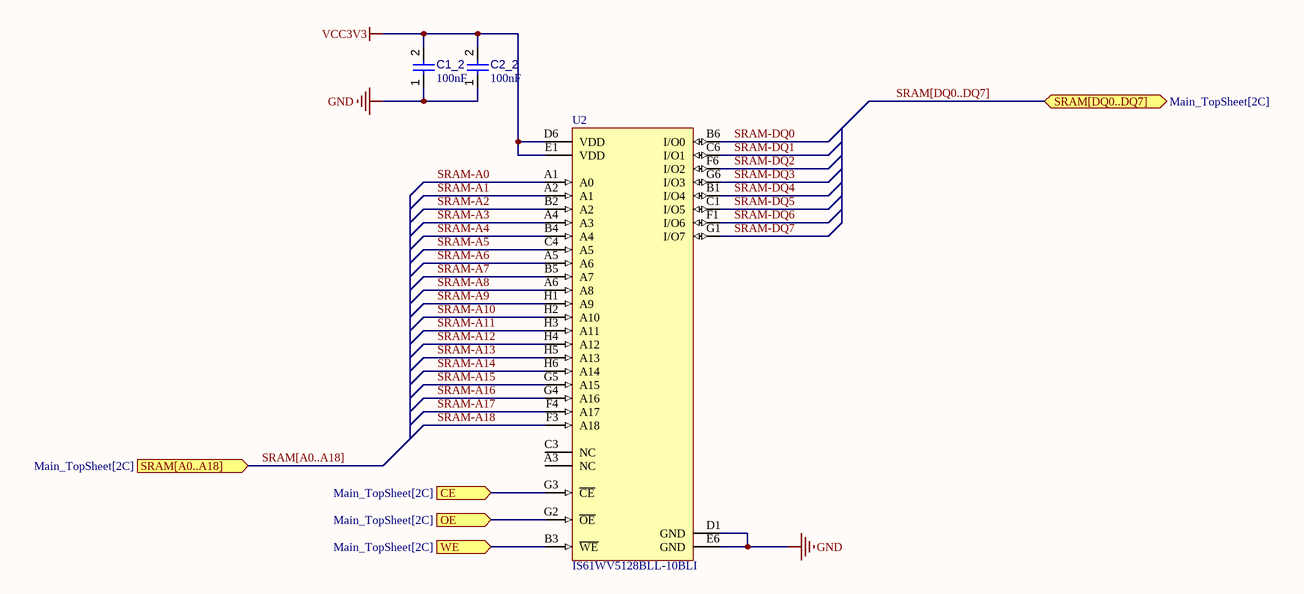
[diagram p5: Memory_SRAM.SchDoc]

### Parts
(Parts that share a designator on the sheet are numbered #1, #2 ... from top to bottom, then left to right.)
C1_2  value 100nF  [CAPC0402(1005)60_L]  (hidden comment: Capacitor 100nF +/-20% 10V 0402)
C2_2  value 100nF  [CAPC0402(1005)60_L]  (hidden comment: Capacitor 100nF +/-20% 10V 0402)
U2#2  IS61WV5128BLL-10BLI  [FP-IS61WV5128BLL-10BLI-IPC_A]

### Ports
CE (in, see Main_TopSheet[2C]), OE (in, see Main_TopSheet[2C]), SRAM[A0..A18] (in, see Main_TopSheet[2C]), SRAM[DQ0..DQ7] (bidir, see Main_TopSheet[2C]), WE (in, see Main_TopSheet[2C])

### Nets
GND: C1_2.1 C2_2.1 U2#2.D1(GND) U2#2.E6(GND)
VCC3V3: C1_2.2 C2_2.2 U2#2.D6(VDD) U2#2.E1(VDD)
SRAM-A0: U2#2.A1(A0)
SRAM-A1: U2#2.A2(A1)
SRAM-A2: U2#2.B2(A2)
SRAM-A3: U2#2.A4(A3)
SRAM-A4: U2#2.B4(A4)
SRAM-A5: U2#2.C4(A5)
SRAM-A6: U2#2.A5(A6)
SRAM-A7: U2#2.B5(A7)
SRAM-A8: U2#2.A6(A8)
SRAM-A9: U2#2.H1(A9)
SRAM-A10: U2#2.H2(A10)
SRAM-A11: U2#2.H3(A11)
SRAM-A12: U2#2.H4(A12)
SRAM-A13: U2#2.H5(A13)
SRAM-A14: U2#2.H6(A14)
SRAM-A15: U2#2.G5(A15)
SRAM-A16: U2#2.G4(A16)
SRAM-A17: U2#2.F4(A17)
SRAM-A18: U2#2.F3(A18)
SRAM-DQ0: U2#2.B6(I/O0)
SRAM-DQ1: U2#2.C6(I/O1)
SRAM-DQ2: U2#2.F6(I/O2)
SRAM-DQ3: U2#2.G6(I/O3)
SRAM-DQ4: U2#2.B1(I/O4)
SRAM-DQ5: U2#2.C1(I/O5)
SRAM-DQ6: U2#2.F1(I/O6)
SRAM-DQ7: U2#2.G1(I/O7)
NetU2#2_B3: U2#2.B3(~{WE}) ; port WE
NetU2#2_G2: U2#2.G2(~{OE}) ; port OE
NetU2#2_G3: U2#2.G3(~{CE}) ; port CE

Not connected (* = marked no-connect by the designer): U2#2 A3(NC) C3(NC)

### Buses and harness runs
bus SRAM[A0..A18] = port SRAM[A0..A18]
bus SRAM[DQ0..DQ7] = port SRAM[DQ0..DQ7]

### Library data of the parts
C1_2 C2_2 = CMP-001-00061-3: as C1 on sheet Sensors; Mounting Technology: SMT; Voltage Rating: 10V; Max Operating Temperature: 85°C; Pins: 2; Case/Package: 0402; Min Operating Temperature: -55°C
U2#2 = CMP-0513-00068-2: NexarPartId: 11886108; Density: 4Mb; Min Supply Voltage: 2.4V; Memory Type: SRAM; Number of Words: 512000; Nominal Supply Current: 40mA; Access Time: 10ns; Interface: Parallel; Memory Size: 512kB; Number of Ports: 1; Word Size: 8b; Sync/Async: Asynchronous; Address Bus Width: 19b; Max Supply Voltage: 3.6V; Number of Pins: 36; RoHS: Compliant; Min Operating Temperature: -40°C; Height: 1.2mm; Case/Package: BGA; Max Operating Temperature: 85°C; Ambient Temperature Range High: 85°C; Schedule B: 8542320040, 8542320040; Radiation Hardening: No

## Sheet Power.SchDoc
size A4; SheetNumber: 7; SheetTotal: 7
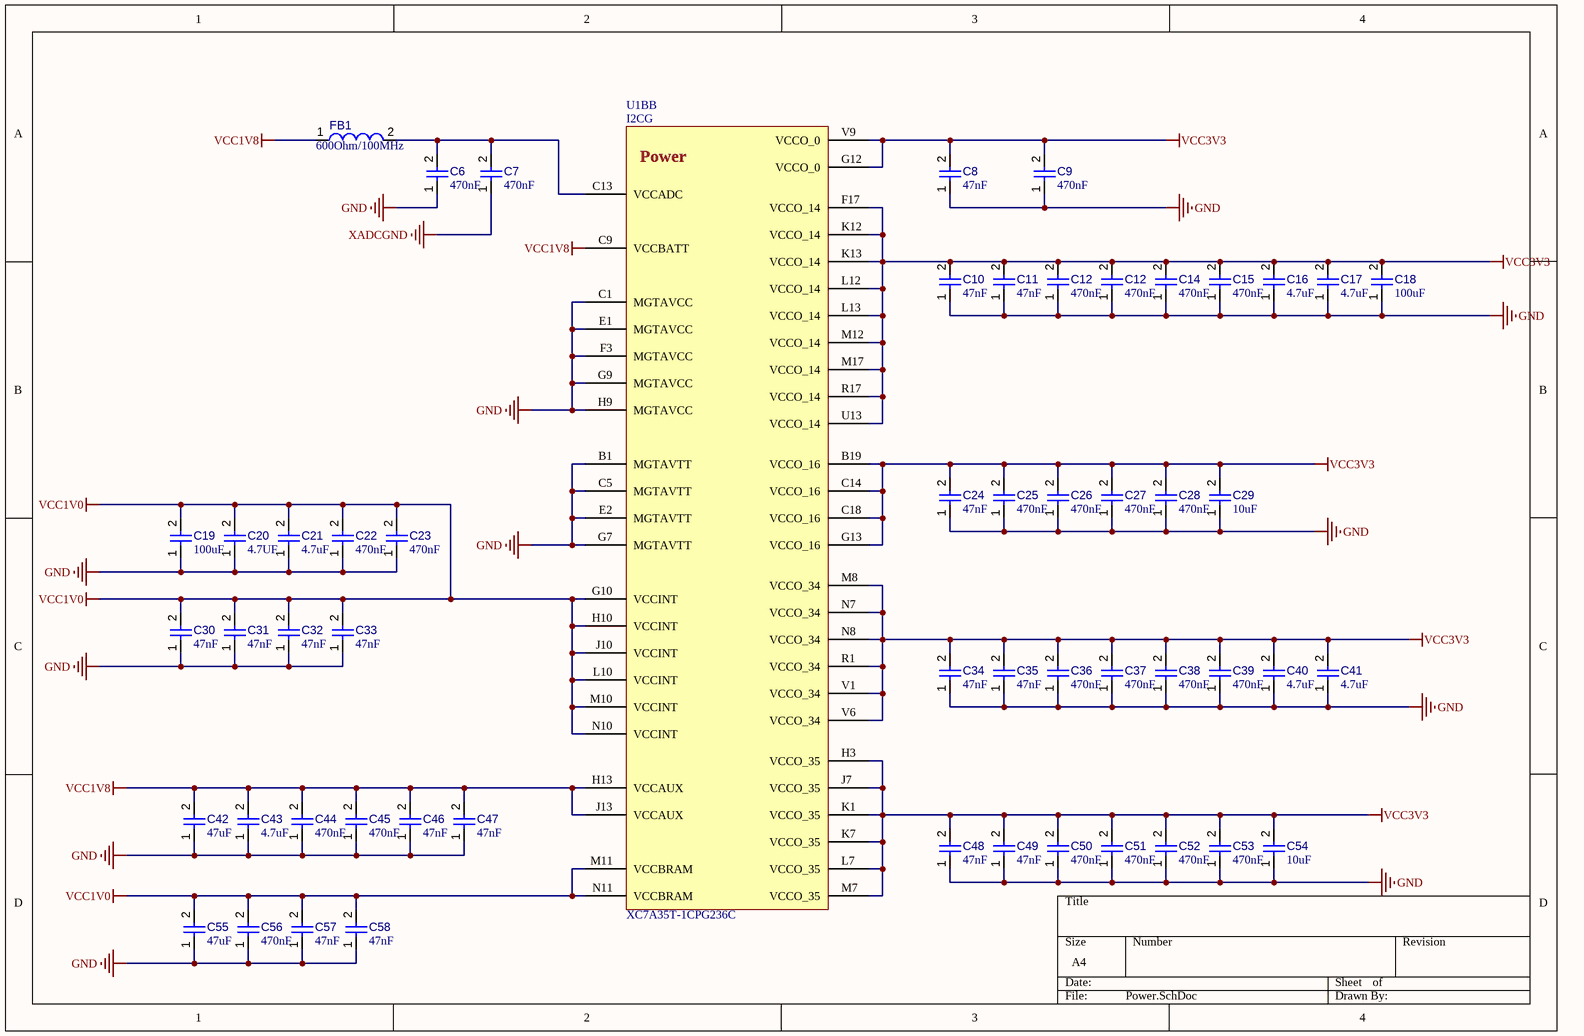
[diagram p6: Power.SchDoc]

### Parts
(Parts that share a designator on the sheet are numbered #1, #2 ... from top to bottom, then left to right.)
C6#2  value 470nF  [CAPC0603(1608)100_L]  (hidden comment: Capacitor 470nF +/-20% 25V 0603)
C7#2  value 470nF  [CAPC0603(1608)100_L]  (hidden comment: Capacitor 470nF +/-20% 25V 0603)
C8#2  value 47nF  [CAPC0603(1608)100_L]  (hidden comment: Capacitor 470nF +/-20% 25V 0603)
C9#2  value 470nF  [CAPC0603(1608)100_L]  (hidden comment: Capacitor 470nF +/-20% 25V 0603)
C10#2  value 47nF  [CAPC0603(1608)100_L]  (hidden comment: Capacitor 470nF +/-20% 25V 0603)
C11  value 47nF  [CAPC0603(1608)100_L]  (hidden comment: Capacitor 470nF +/-20% 25V 0603)
C12#2  value 470nF  [CAPC0603(1608)100_L]  (hidden comment: Capacitor 470nF +/-20% 25V 0603)
C12#3  value 470nF  [CAPC0603(1608)100_L]  (hidden comment: Capacitor 470nF +/-20% 25V 0603)
C14#2  value 470nF  [CAPC0603(1608)100_L]  (hidden comment: Capacitor 470nF +/-20% 25V 0603)
C15#3  value 470nF  [CAPC0603(1608)100_L]  (hidden comment: Capacitor 470nF +/-20% 25V 0603)
C16#2  value 4.7uF  [CAPC0603(1608)100_L]  (hidden comment: Capacitor 470nF +/-20% 25V 0603)
C17#2  value 4.7uF  [CAPC0603(1608)100_L]  (hidden comment: Capacitor 470nF +/-20% 25V 0603)
C18#2  value 100uF  [CAPC0603(1608)100_L]  (hidden comment: Capacitor 470nF +/-20% 25V 0603)
C19  value 100uF  [CAPC0603(1608)100_L]  (hidden comment: Capacitor 470nF +/-20% 25V 0603)
C20  value 4.7UF  [CAPC0603(1608)100_L]  (hidden comment: Capacitor 470nF +/-20% 25V 0603)
C21  value 4.7uF  [CAPC0603(1608)100_L]  (hidden comment: Capacitor 470nF +/-20% 25V 0603)
C22  value 470nF  [CAPC0603(1608)100_L]  (hidden comment: Capacitor 470nF +/-20% 25V 0603)
C23  value 470nF  [CAPC0603(1608)100_L]  (hidden comment: Capacitor 470nF +/-20% 25V 0603)
C24  value 47nF  [CAPC0603(1608)100_L]  (hidden comment: Capacitor 470nF +/-20% 25V 0603)
C25  value 470nF  [CAPC0603(1608)100_L]  (hidden comment: Capacitor 470nF +/-20% 25V 0603)
C26  value 470nF  [CAPC0603(1608)100_L]  (hidden comment: Capacitor 470nF +/-20% 25V 0603)
C27  value 470nF  [CAPC0603(1608)100_L]  (hidden comment: Capacitor 470nF +/-20% 25V 0603)
C28  value 470nF  [CAPC0603(1608)100_L]  (hidden comment: Capacitor 470nF +/-20% 25V 0603)
C29  value 10uF  [CAPC0603(1608)100_L]  (hidden comment: Capacitor 470nF +/-20% 25V 0603)
C30  value 47nF  [CAPC0603(1608)100_L]  (hidden comment: Capacitor 470nF +/-20% 25V 0603)
C31  value 47nF  [CAPC0603(1608)100_L]  (hidden comment: Capacitor 470nF +/-20% 25V 0603)
C32  value 47nF  [CAPC0603(1608)100_L]  (hidden comment: Capacitor 470nF +/-20% 25V 0603)
C33  value 47nF  [CAPC0603(1608)100_L]  (hidden comment: Capacitor 470nF +/-20% 25V 0603)
C34  value 47nF  [CAPC0603(1608)100_L]  (hidden comment: Capacitor 470nF +/-20% 25V 0603)
C35  value 47nF  [CAPC0603(1608)100_L]  (hidden comment: Capacitor 470nF +/-20% 25V 0603)
C36  value 470nF  [CAPC0603(1608)100_L]  (hidden comment: Capacitor 470nF +/-20% 25V 0603)
C37  value 470nF  [CAPC0603(1608)100_L]  (hidden comment: Capacitor 470nF +/-20% 25V 0603)
C38  value 470nF  [CAPC0603(1608)100_L]  (hidden comment: Capacitor 470nF +/-20% 25V 0603)
C39  value 470nF  [CAPC0603(1608)100_L]  (hidden comment: Capacitor 470nF +/-20% 25V 0603)
C40  value 4.7uF  [CAPC0603(1608)100_L]  (hidden comment: Capacitor 470nF +/-20% 25V 0603)
C41  value 4.7uF  [CAPC0603(1608)100_L]  (hidden comment: Capacitor 470nF +/-20% 25V 0603)
C42  value 47uF  [CAPC0603(1608)100_L]  (hidden comment: Capacitor 470nF +/-20% 25V 0603)
C43  value 4.7uF  [CAPC0603(1608)100_L]  (hidden comment: Capacitor 470nF +/-20% 25V 0603)
C44  value 470nF  [CAPC0603(1608)100_L]  (hidden comment: Capacitor 470nF +/-20% 25V 0603)
C45  value 470nF  [CAPC0603(1608)100_L]  (hidden comment: Capacitor 470nF +/-20% 25V 0603)
C46  value 47nF  [CAPC0603(1608)100_L]  (hidden comment: Capacitor 470nF +/-20% 25V 0603)
C47  value 47nF  [CAPC0603(1608)100_L]  (hidden comment: Capacitor 470nF +/-20% 25V 0603)
C48  value 47nF  [CAPC0603(1608)100_L]  (hidden comment: Capacitor 470nF +/-20% 25V 0603)
C49  value 47nF  [CAPC0603(1608)100_L]  (hidden comment: Capacitor 470nF +/-20% 25V 0603)
C50  value 470nF  [CAPC0603(1608)100_L]  (hidden comment: Capacitor 470nF +/-20% 25V 0603)
C51  value 470nF  [CAPC0603(1608)100_L]  (hidden comment: Capacitor 470nF +/-20% 25V 0603)
C52  value 470nF  [CAPC0603(1608)100_L]  (hidden comment: Capacitor 470nF +/-20% 25V 0603)
C53  value 470nF  [CAPC0603(1608)100_L]  (hidden comment: Capacitor 470nF +/-20% 25V 0603)
C54  value 10uF  [CAPC0603(1608)100_L]  (hidden comment: Capacitor 470nF +/-20% 25V 0603)
C55  value 47uF  [CAPC0603(1608)100_L]  (hidden comment: Capacitor 470nF +/-20% 25V 0603)
C56  value 470nF  [CAPC0603(1608)100_L]  (hidden comment: Capacitor 470nF +/-20% 25V 0603)
C57  value 47nF  [CAPC0603(1608)100_L]  (hidden comment: Capacitor 470nF +/-20% 25V 0603)
C58  value 47nF  [CAPC0603(1608)100_L]  (hidden comment: Capacitor 470nF +/-20% 25V 0603)
FB1  value 600Ohm/100MHz  [TDK-VLCF5028-2_V]  (hidden comment: VLCF5028T-2R7N1R8-2)
U1B  XC7A35T-1CPG236C  [BGA81C50P19X19_1000X1000X110]  (part B of 4)

### Nets
GND: C6#2.1 C8#2.1 C9#2.1 C10#2.1 C11.1 C12#2.1 C12#3.1 C14#2.1 C15#3.1 C16#2.1 C17#2.1 C18#2.1 C19.1 C20.1 C21.1 C22.1 C23.1 C24.1 C25.1 C26.1 C27.1 C28.1 C29.1 C30.1 C31.1 C32.1 C33.1 C34.1 C35.1 C36.1 C37.1 C38.1 C39.1 C40.1 C41.1 C42.1 C43.1 C44.1 C45.1 C46.1 C47.1 C48.1 C49.1 C50.1 C51.1 C52.1 C53.1 C54.1 C55.1 C56.1 C57.1 C58.1 U1B.B1(MGTAVTT) U1B.C1(MGTAVCC) U1B.C5(MGTAVTT) U1B.E1(MGTAVCC) U1B.E2(MGTAVTT) U1B.F3(MGTAVCC) U1B.G7(MGTAVTT) U1B.G9(MGTAVCC) U1B.H9(MGTAVCC)
VCC1V0: C19.2 C20.2 C21.2 C22.2 C23.2 C30.2 C31.2 C32.2 C33.2 C55.2 C56.2 C57.2 C58.2 U1B.G10(VCCINT) U1B.H10(VCCINT) U1B.J10(VCCINT) U1B.L10(VCCINT) U1B.M10(VCCINT) U1B.M11(VCCBRAM) U1B.N10(VCCINT) U1B.N11(VCCBRAM)
VCC1V8: C42.2 C43.2 C44.2 C45.2 C46.2 C47.2 FB1.1 U1B.C9(VCCBATT) U1B.H13(VCCAUX) U1B.J13(VCCAUX)
VCC3V3: C8#2.2 C9#2.2 C10#2.2 C11.2 C12#2.2 C12#3.2 C14#2.2 C15#3.2 C16#2.2 C17#2.2 C18#2.2 C24.2 C25.2 C26.2 C27.2 C28.2 C29.2 C34.2 C35.2 C36.2 C37.2 C38.2 C39.2 C40.2 C41.2 C48.2 C49.2 C50.2 C51.2 C52.2 C53.2 C54.2 U1B.B19(VCCO_16) U1B.C14(VCCO_16) U1B.C18(VCCO_16) U1B.F17(VCCO_14) U1B.G12(VCCO_0) U1B.G13(VCCO_16) U1B.H3(VCCO_35) U1B.J7(VCCO_35) U1B.K1(VCCO_35) U1B.K7(VCCO_35) U1B.K12(VCCO_14) U1B.K13(VCCO_14) U1B.L7(VCCO_35) U1B.L12(VCCO_14) U1B.L13(VCCO_14) U1B.M7(VCCO_35) U1B.M8(VCCO_34) U1B.M12(VCCO_14) U1B.M17(VCCO_14) U1B.N7(VCCO_34) U1B.N8(VCCO_34) U1B.R1(VCCO_34) U1B.R17(VCCO_14) U1B.U13(VCCO_14) U1B.V1(VCCO_34) U1B.V6(VCCO_34) U1B.V9(VCCO_0)
XADCGND: C7#2.1
NetC6#2_2: C6#2.2 C7#2.2 FB1.2 U1B.C13(VCCADC)

### Notes on the sheet
- (in symbol CMP-020-00032-3, part B) I2CG; Power

### Library data of the parts
C6#2 C7#2 C8#2 C9#2 C10#2 C11 C12#2 C12#3 C14#2 C15#3 C16#2 C17#2 C18#2 C19-C58 = CMP-001-00077-3: Chip Capacitor, 470nF +/-20%, 25V, 0603, Thickness 1 mm; Tolerance: 10%; Max Operating Temperature: 85°C; Voltage Rating: 25V; Pins: 2; Case/Package: 0603; Mounting Technology: SMT; Min Operating Temperature: -55°C
FB1 = CMP-006-00017-6: Inductor for Power Circuits, 2.7 uH, +/- 30%,100 KHz, 1.82 A, -40 to 105 degC, 2-Pin SMD, RoHS, Reel; Manufacturer: TDK; Resistance: 0.033Ohm; Shielding: Shielded; Core Material: Ferrite; Current Rating: 1.82A; Tolerance: 30%; Package Quantity: 500; Datasheet Version: Apr-16; Max Operating Temperature: 105°C; RoHS Compliant: True; Min Operating Temperature: -40°C; Datasheet URL: https://product.tdk.com/info/en/catalog/datasheets/inductor_commercial_power_vlcf5028-2_en.pdf; Packaging: TapeandReel; Package Description: 2-Pin Surface Mount Device, Body 5.2 x 5.3 mm; Mounting Technology: SM; Saturation Current: 1.82A; Inductance Tolerance: 30%; Package Reference: VLCF5028-2; Case/Package: 5028
U1B = CMP-020-00032-3: as U1D on sheet System; Min Operating Temperature: 0°C; Case/Package: LFBGA; Pins: 236; Max Operating Temperature: 85°C

## Nets that join several sheets
GND: Main_TopSheet (Y2.3), Sensors (28 pins), Telemetry (C12#1.2 C13.2 C14#1.1 C15#1.1), Actuators_Power (18 pins), System (5 pins), Memory_SRAM (C1_2.1 C2_2.1 U2#2.D1 U2#2.E6), Power (61 pins)
VCC3V3: Main_TopSheet (Y2.1 Y2.6), Sensors (25 pins), Telemetry (R9.1), Actuators_Power (5 pins), System (9 pins), Memory_SRAM (C1_2.2 C2_2.2 U2#2.D6 U2#2.E1), Power (59 pins)
XADCGND: System (U1A.A12 U1A.A13 U1A.B12 U1A.B13), Power (C7#2.1)
NetU1C_L17: Main_TopSheet (Y2.4), System (U1C.L17)